# Altium schematic sheet LTC2380IMS-24#PBF_2020-12-23_20-21-40.schdoc
size 67 x 45 mm
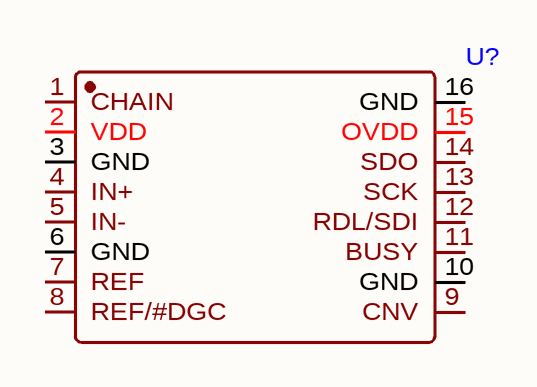
[diagram p0: LTC2380IMS-24#PBF_2020-12-23_20-21-40.schdoc]

## Parts
U?  (no value)  [MSOP-16_L4.0-W3.0-P0.50-LS4.9-BL]

## Nets

Not connected (* = marked no-connect by the designer): U? 1(CHAIN) 2(VDD) 3(GND) 4(IN+) 5(IN-) 6(GND) 7(REF) 8(REF/#DGC) 9(CNV) 10(GND) 11(BUSY) 12(RDL/SDI) 13(SCK) 14(SDO) 15(OVDD) 16(GND)

## Library data of the parts
U? = LTC2380IMS-24#PBF